# Altium schematic sheet Analog_Input.SchDoc
size A
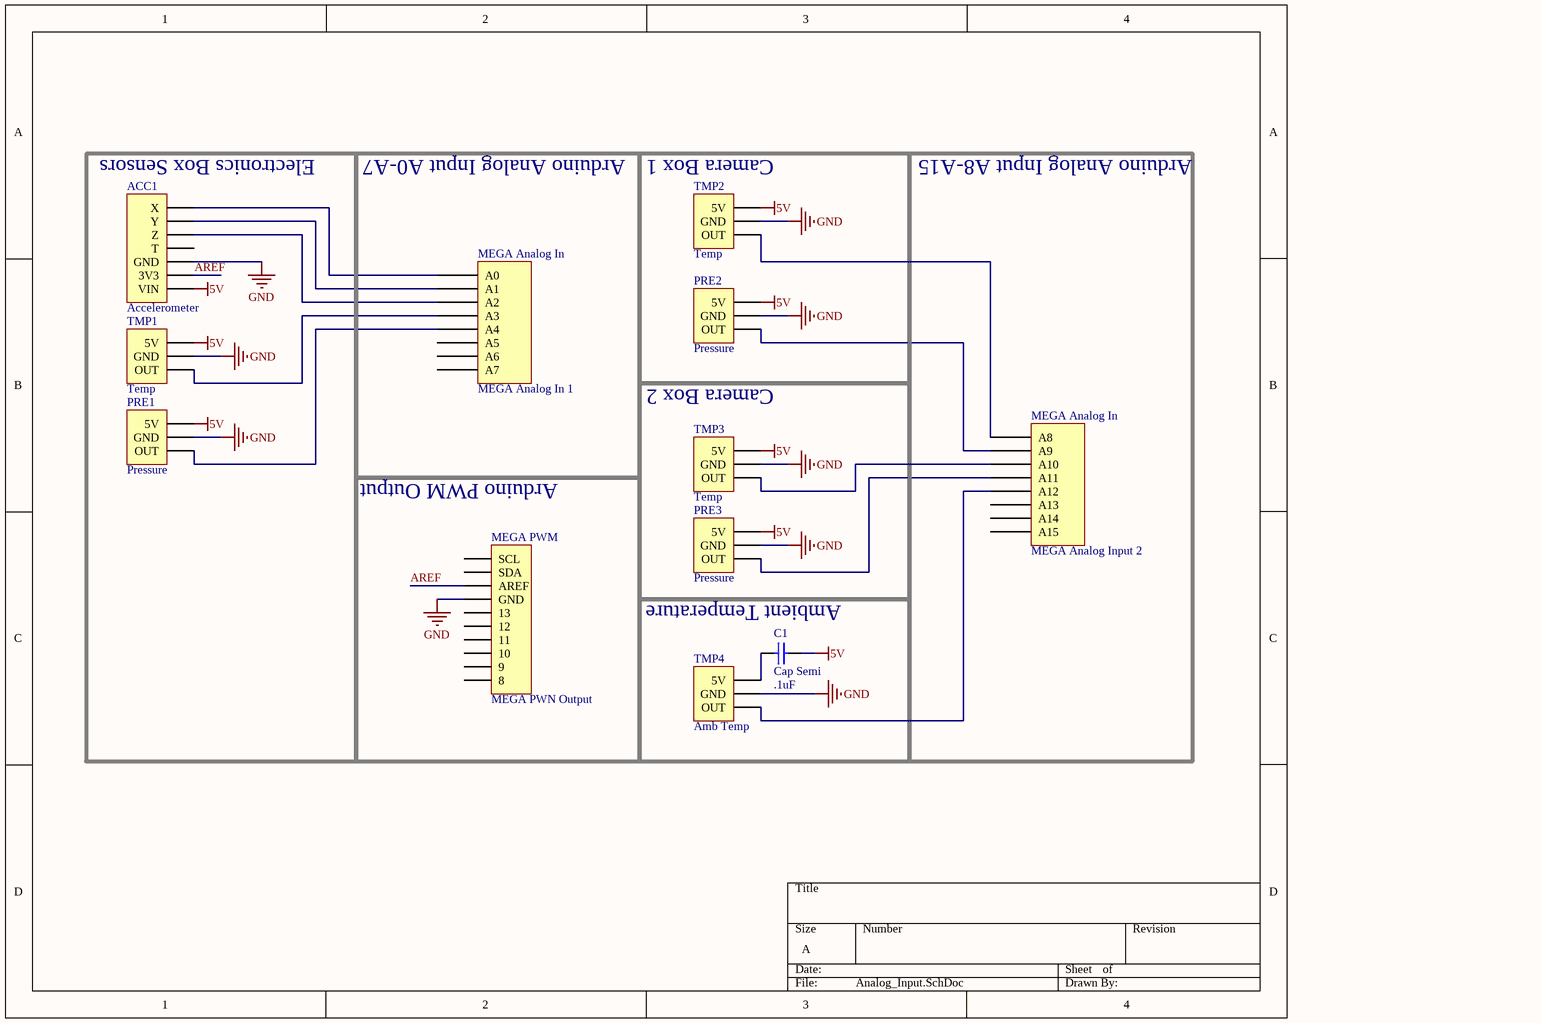
[diagram p0: Analog_Input.SchDoc]

## Parts
(Parts that share a designator on the sheet are numbered #1, #2 ... from top to bottom, then left to right.)
ACC1  Accelerometer  [HDR1X7]
C1  Cap Semi  value .1uF  [0402]
MEGA_Analog_In#1  MEGA Analog In 1  [HDR1X8]
MEGA_Analog_In#2  MEGA Analog Input 2  [HDR1X8]
MEGA_PWM  MEGA PWN Output  [HDR1X10]
PRE1  Pressure  [HDR1X3]
PRE2  Pressure  [HDR1X3]
PRE3  Pressure  [HDR1X3]
TMP1  Temp  [HDR1X3]
TMP2  Temp  [HDR1X3]
TMP3  Temp  [HDR1X3]
TMP4  Amb Temp  [HDR1X3]

## Blocks framed on the sheet
Electronics Box Sensors: ACC1 PRE1 TMP1
Arduino Analog Input A0-A7: MEGA_Analog_In#1
Camera Box 1: PRE2 TMP2
Arduino Analog Input A8-A15: MEGA_Analog_In#2
Camera Box 2: PRE3 TMP3
Arduino PWM Output: MEGA_PWM
Ambient Temperature: C1 TMP4

## Nets
5V: ACC1.1(VIN) C1.1 PRE1.1(5V) PRE2.1(5V) PRE3.1(5V) TMP1.1(5V) TMP2.1(5V) TMP3.1(5V)
GND: ACC1.3(GND) MEGA_PWM.4(GND) PRE1.2(GND) PRE2.2(GND) PRE3.2(GND) TMP1.2(GND) TMP2.2(GND) TMP3.2(GND) TMP4.2(GND)
AREF: ACC1.2(3V3) MEGA_PWM.3(AREF)
NetACC1_5: ACC1.5(Z) MEGA_Analog_In#1.3(A2)
NetACC1_6: ACC1.6(Y) MEGA_Analog_In#1.2(A1)
NetACC1_7: ACC1.7(X) MEGA_Analog_In#1.1(A0)
NetC1_2: C1.2 TMP4.1(5V)
NetMEGA_Analog_In#1_4: MEGA_Analog_In#1.4(A3) TMP1.3(OUT)
NetMEGA_Analog_In#1_5: MEGA_Analog_In#1.5(A4) PRE1.3(OUT)
NetMEGA_Analog_In#2_1: MEGA_Analog_In#2.1(A8) TMP2.3(OUT)
NetMEGA_Analog_In#2_2: MEGA_Analog_In#2.2(A9) PRE2.3(OUT)
NetMEGA_Analog_In#2_3: MEGA_Analog_In#2.3(A10) TMP3.3(OUT)
NetMEGA_Analog_In#2_4: MEGA_Analog_In#2.4(A11) PRE3.3(OUT)
NetMEGA_Analog_In#2_5: MEGA_Analog_In#2.5(A12) TMP4.3(OUT)

Not connected (* = marked no-connect by the designer): ACC1 4(T); MEGA_Analog_In#1 6(A5) 7(A6) 8(A7); MEGA_Analog_In#2 6(A13) 7(A14) 8(A15); MEGA_PWM 1(SCL) 2(SDA) 5(13) 6(12) 7(11) 8(10) 9 10(8)

## Library data of the parts
ACC1 = Header 7: Header, 7-Pin; LatestRevisionDate: 17-Jul-2002; LatestRevisionNote: Re-released for DXP Platform.; Publisher: Altium Limited
C1 = Cap Semi: Capacitor (Semiconductor SIM Model); Published: 8-Jun-2000; LatestRevisionDate: 29-May-2009; LatestRevisionNote: IPC-7351 Footprint Added.; PackageReference: C1206; Publisher: Altium Limited; PackageDescription: Chip Capacitor
MEGA_Analog_In#1 MEGA_Analog_In#2 = Component_1
MEGA_PWM = Header 10: Header, 10-Pin; LatestRevisionDate: 17-Jul-2002; LatestRevisionNote: Re-released for DXP Platform.; Publisher: Altium Limited
PRE1-PRE3 TMP1-TMP4 = Header 3: Header, 3-Pin; LatestRevisionDate: 17-Jul-2002; LatestRevisionNote: Re-released for DXP Platform.; Publisher: Altium Limited